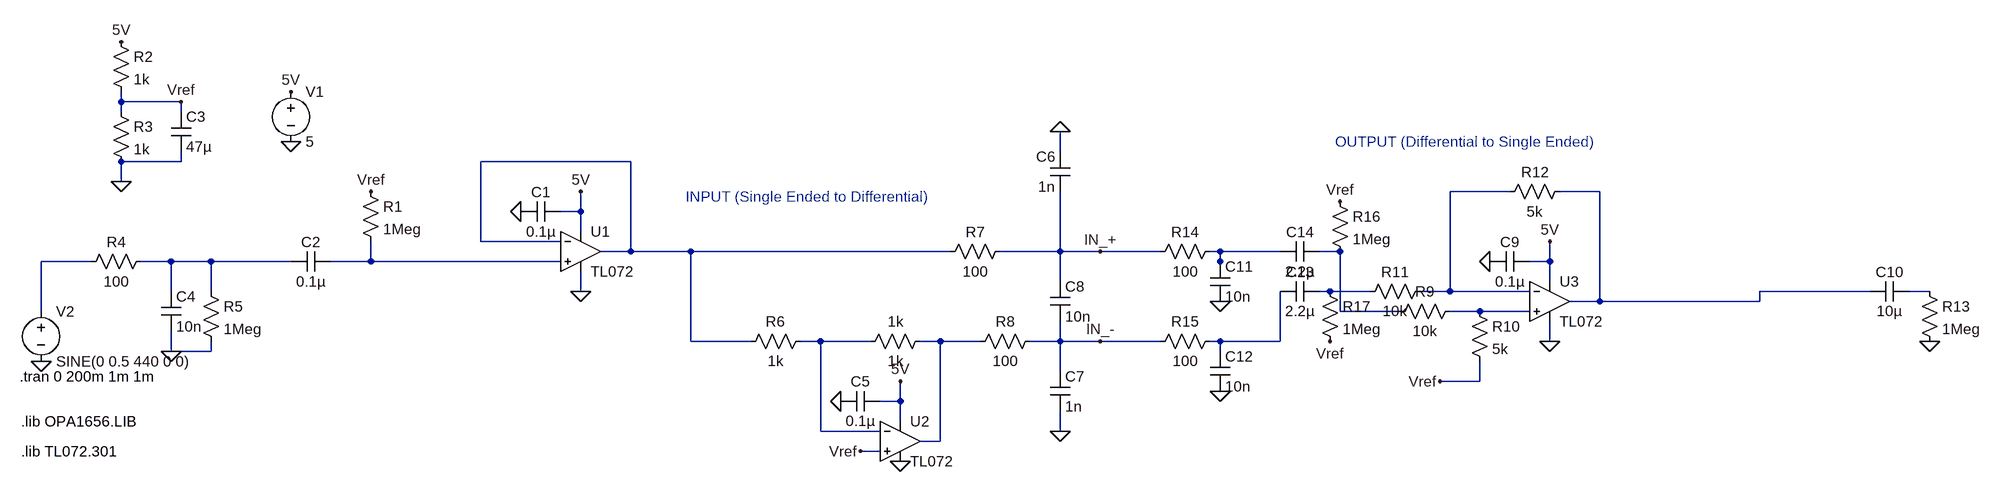
[diagram p0: schematic Differential_OpAmp_Buffer.asc]
Differential_OpAmp_Buffer.asc, the LTspice schematic file:
Version 4
SHEET 1 2312 680
WIRE -832 -144 -832 -160
WIRE -736 -144 -832 -144
WIRE -832 -128 -832 -144
WIRE -736 -128 -736 -144
WIRE 672 -64 672 -96
WIRE -736 -48 -736 -64
WIRE -736 -48 -832 -48
WIRE -16 -48 -256 -48
WIRE -832 -16 -832 -48
WIRE 1392 0 1296 0
WIRE 1536 0 1472 0
WIRE -96 32 -96 0
WIRE -96 32 -128 32
WIRE -96 64 -96 32
WIRE -256 80 -256 -48
WIRE -128 80 -256 80
WIRE -16 96 -16 -48
WIRE -16 96 -64 96
WIRE 80 96 -16 96
WIRE 496 96 80 96
WIRE 672 96 672 0
WIRE 672 96 576 96
WIRE 736 96 672 96
WIRE 832 96 736 96
WIRE 928 96 912 96
WIRE 1024 96 928 96
WIRE 1120 96 1088 96
WIRE -880 112 -960 112
WIRE -752 112 -800 112
WIRE -688 112 -752 112
WIRE -560 112 -688 112
WIRE -432 112 -432 80
WIRE -432 112 -496 112
WIRE -128 112 -432 112
WIRE 928 112 928 96
WIRE 1456 112 1456 80
WIRE 1456 112 1424 112
WIRE 928 128 928 112
WIRE 672 144 672 96
WIRE 1456 144 1456 112
WIRE -752 160 -752 112
WIRE -688 160 -688 112
WIRE -96 160 -96 128
WIRE 1104 160 1088 160
WIRE 1168 160 1104 160
WIRE 1296 160 1296 0
WIRE 1296 160 1248 160
WIRE 1424 160 1296 160
WIRE 1968 160 1792 160
WIRE 2064 160 2032 160
WIRE 1536 176 1536 0
WIRE 1536 176 1488 176
WIRE 1792 176 1792 160
WIRE 1792 176 1536 176
WIRE -960 192 -960 112
WIRE 1120 192 1120 96
WIRE 1216 192 1120 192
WIRE 1344 192 1296 192
WIRE 1424 192 1344 192
WIRE 80 240 80 96
WIRE 176 240 80 240
WIRE 288 240 256 240
WIRE 368 240 288 240
WIRE 480 240 448 240
WIRE 544 240 480 240
WIRE 672 240 672 208
WIRE 672 240 624 240
WIRE 736 240 672 240
WIRE 832 240 736 240
WIRE 928 240 912 240
WIRE 1024 240 1024 160
WIRE 1024 240 928 240
WIRE 1456 240 1456 208
WIRE -752 256 -752 224
WIRE -688 256 -688 240
WIRE -688 256 -752 256
WIRE 928 256 928 240
WIRE 672 288 672 240
WIRE 1344 304 1344 272
WIRE 1344 304 1280 304
WIRE 416 336 416 304
WIRE 416 336 384 336
WIRE 416 368 416 336
WIRE 288 384 288 240
WIRE 384 384 288 384
WIRE 672 384 672 352
WIRE 480 400 480 240
WIRE 480 400 448 400
WIRE 384 416 352 416
FLAG -560 -80 0
FLAG -560 -160 5V
FLAG -96 0 5V
FLAG -192 32 0
FLAG -960 272 0
FLAG -832 -16 0
FLAG -832 -240 5V
FLAG -736 -144 Vref
FLAG -432 0 Vref
FLAG -752 256 0
FLAG -96 160 0
FLAG 416 304 5V
FLAG 320 336 0
FLAG 416 432 0
FLAG 672 -96 0
FLAG 672 384 0
FLAG 352 416 Vref
FLAG 1456 80 5V
FLAG 1360 112 0
FLAG 1456 240 0
FLAG 1280 304 Vref
FLAG 736 96 IN_+
FLAG 736 240 IN_-
FLAG 2064 240 0
FLAG 928 176 0
FLAG 928 320 0
FLAG 1120 16 Vref
FLAG 1104 240 Vref
SYMBOL OpAmps\\opamp2 -96 32 R0
SYMATTR InstName U1
SYMATTR Value TL072
SYMATTR SpiceModel TL072
SYMBOL voltage -560 -176 R0
WINDOW 123 0 0 Left 0
WINDOW 39 0 0 Left 0
SYMATTR InstName V1
SYMATTR Value 5
SYMBOL cap -128 16 R90
WINDOW 0 0 32 VBottom 2
WINDOW 3 32 32 VTop 2
SYMATTR InstName C1
SYMATTR Value 0.1µ
SYMBOL voltage -960 176 R0
WINDOW 123 0 0 Left 0
WINDOW 39 0 0 Left 0
SYMATTR InstName V2
SYMATTR Value SINE(0 0.5 440 0 0)
SYMBOL cap -496 96 R90
WINDOW 0 0 32 VBottom 2
WINDOW 3 32 32 VTop 2
SYMATTR InstName C2
SYMATTR Value 0.1µ
SYMBOL res -448 -16 R0
SYMATTR InstName R1
SYMATTR Value 1Meg
SYMBOL res -848 -256 R0
SYMATTR InstName R2
SYMATTR Value 1k
SYMBOL res -848 -144 R0
SYMATTR InstName R3
SYMATTR Value 1k
SYMBOL cap -752 -128 R0
SYMATTR InstName C3
SYMATTR Value 47µ
SYMBOL res -784 96 R90
WINDOW 0 0 56 VBottom 2
WINDOW 3 32 56 VTop 2
SYMATTR InstName R4
SYMATTR Value 100
SYMBOL cap -768 160 R0
SYMATTR InstName C4
SYMATTR Value 10n
SYMBOL res -704 144 R0
SYMATTR InstName R5
SYMATTR Value 1Meg
SYMBOL res 272 224 R90
WINDOW 0 0 56 VBottom 2
WINDOW 3 32 56 VTop 2
SYMATTR InstName R6
SYMATTR Value 1k
SYMBOL res 464 224 R90
WINDOW 0 0 56 VBottom 2
WINDOW 3 32 56 VTop 2
SYMATTR InstName 1k
SYMATTR Value 1k
SYMBOL OpAmps\\opamp2 416 336 R0
SYMATTR InstName U2
SYMATTR Value TL072
SYMATTR SpiceModel TL072
SYMBOL cap 384 320 R90
WINDOW 0 0 32 VBottom 2
WINDOW 3 32 32 VTop 2
SYMATTR InstName C5
SYMATTR Value 0.1µ
SYMBOL res 592 80 R90
WINDOW 0 0 56 VBottom 2
WINDOW 3 32 56 VTop 2
SYMATTR InstName R7
SYMATTR Value 100
SYMBOL cap 688 0 R180
WINDOW 0 24 56 Left 2
WINDOW 3 24 8 Left 2
SYMATTR InstName C6
SYMATTR Value 1n
SYMBOL res 640 224 R90
WINDOW 0 0 56 VBottom 2
WINDOW 3 32 56 VTop 2
SYMATTR InstName R8
SYMATTR Value 100
SYMBOL cap 656 288 R0
SYMATTR InstName C7
SYMATTR Value 1n
SYMBOL cap 656 144 R0
SYMATTR InstName C8
SYMATTR Value 10n
SYMBOL OpAmps\\opamp2 1456 112 R0
SYMATTR InstName U3
SYMATTR Value TL072
SYMATTR SpiceModel TL072
SYMBOL cap 1424 96 R90
WINDOW 0 0 32 VBottom 2
WINDOW 3 32 32 VTop 2
SYMATTR InstName C9
SYMATTR Value 0.1µ
SYMBOL res 1312 176 R90
WINDOW 0 0 56 VBottom 2
WINDOW 3 32 56 VTop 2
SYMATTR InstName R9
SYMATTR Value 10k
SYMBOL res 1264 144 R90
WINDOW 0 0 56 VBottom 2
WINDOW 3 32 56 VTop 2
SYMATTR InstName R11
SYMATTR Value 10k
SYMBOL res 1488 -16 R90
WINDOW 0 0 56 VBottom 2
WINDOW 3 32 56 VTop 2
SYMATTR InstName R12
SYMATTR Value 5k
SYMBOL res 1328 176 R0
SYMATTR InstName R10
SYMATTR Value 5k
SYMBOL cap 2032 144 R90
WINDOW 0 0 32 VBottom 2
WINDOW 3 32 32 VTop 2
SYMATTR InstName C10
SYMATTR Value 10µ
SYMBOL res 2048 144 R0
SYMATTR InstName R13
SYMATTR Value 1Meg
SYMBOL cap 912 112 R0
SYMATTR InstName C11
SYMATTR Value 10n
SYMBOL cap 912 256 R0
SYMATTR InstName C12
SYMATTR Value 10n
SYMBOL res 928 80 R90
WINDOW 0 0 56 VBottom 2
WINDOW 3 32 56 VTop 2
SYMATTR InstName R14
SYMATTR Value 100
SYMBOL res 928 224 R90
WINDOW 0 0 56 VBottom 2
WINDOW 3 32 56 VTop 2
SYMATTR InstName R15
SYMATTR Value 100
SYMBOL cap 1088 144 R90
WINDOW 0 0 32 VBottom 2
WINDOW 3 32 32 VTop 2
SYMATTR InstName C13
SYMATTR Value 2.2µ
SYMBOL cap 1088 80 R90
WINDOW 0 0 32 VBottom 2
WINDOW 3 32 32 VTop 2
SYMATTR InstName C14
SYMATTR Value 2.2µ
SYMBOL res 1104 0 R0
SYMATTR InstName R16
SYMATTR Value 1Meg
SYMBOL res 1088 144 R0
SYMATTR InstName R17
SYMATTR Value 1Meg
TEXT -992 368 Left 2 !.lib OPA1656.LIB
TEXT -994 296 Left 2 !.tran 0 200m 1m 1m
TEXT 72 8 Left 2 ;INPUT (Single Ended to Differential)
TEXT 1112 -80 Left 2 ;OUTPUT (Differential to Single Ended)
TEXT -992 416 Left 2 !.lib TL072.301

The netlist it stands for:
* Differential_OpAmp_Buffer.asc
XU1 N008 N001 5V 0 N001 TL072 TL072  ; pins In+ In- V+ V- OUT
V1 5V 0 5
C1 5V 0 0.1µ
V2 N006 0 SINE(0 0.5 440 0 0)
C2 N008 N007 0.1µ
R1 Vref N008 1Meg
R2 5V Vref 1k
R3 Vref 0 1k
C3 Vref 0 47µ
R4 N007 N006 100
C4 N007 0 10n
R5 N007 0 1Meg
R6 N012 N001 1k
R§1k N013 N012 1k
XU2 Vref N012 5V 0 N013 TL072 TL072  ; pins In+ In- V+ V- OUT
C5 5V 0 0.1µ
R7 IN_+ N001 100
C6 IN_+ 0 1n
R8 IN_- N013 100
C7 IN_- 0 1n
C8 IN_+ IN_- 10n
XU3 N011 N002 5V 0 N003 TL072 TL072  ; pins In+ In- V+ V- OUT
C9 5V 0 0.1µ
R9 N011 N005 10k
R11 N002 N009 10k
R12 N003 N002 5k
R10 N011 Vref 5k
C10 N010 N003 10µ
R13 N010 0 1Meg
C11 N004 0 10n
C12 N014 0 10n
R14 N004 IN_+ 100
R15 N014 IN_- 100
C13 N009 N014 2.2µ
C14 N005 N004 2.2µ
R16 Vref N005 1Meg
R17 N009 Vref 1Meg
.lib OPA1656.LIB
.tran 0 200m 1m 1m
* INPUT (Single Ended to Differential)
* OUTPUT (Differential to Single Ended)
.lib TL072.301
.backanno
.end